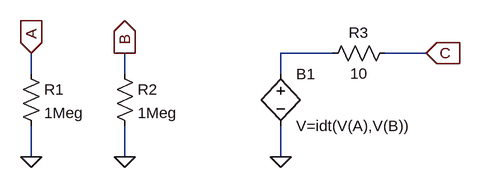
[diagram p0: schematic Integrator5.asc]
Integrator5.asc, the LTspice schematic file:
Version 4
SHEET 1 880 680
WIRE 384 80 304 80
WIRE 528 80 464 80
WIRE -80 112 -80 80
WIRE 64 112 64 80
WIRE 304 112 304 80
WIRE -80 240 -80 192
WIRE 64 240 64 192
WIRE 304 240 304 192
FLAG -80 80 A
IOPIN -80 80 In
FLAG -80 240 0
FLAG 64 240 0
FLAG 304 240 0
FLAG 64 80 B
IOPIN 64 80 Out
FLAG 528 80 C
IOPIN 528 80 In
SYMBOL bv 304 96 R0
SYMATTR InstName B1
SYMATTR Value V=idt(V(A),V(B))
SYMBOL res -96 96 R0
SYMATTR InstName R1
SYMATTR Value 1Meg
SYMBOL res 48 96 R0
SYMATTR InstName R2
SYMATTR Value 1Meg
SYMBOL res 480 64 R90
WINDOW 0 0 56 VBottom 2
WINDOW 3 32 56 VTop 2
SYMATTR InstName R3
SYMATTR Value 10

The netlist it stands for:
* Integrator5.asc
B1 N001 0 V=idt(V(A),V(B))
R1 A 0 1Meg
R2 B 0 1Meg
R3 C N001 10
.backanno
.end